# Altium project FPGA_XC6SLX9_2TQG144C.PrjPcb
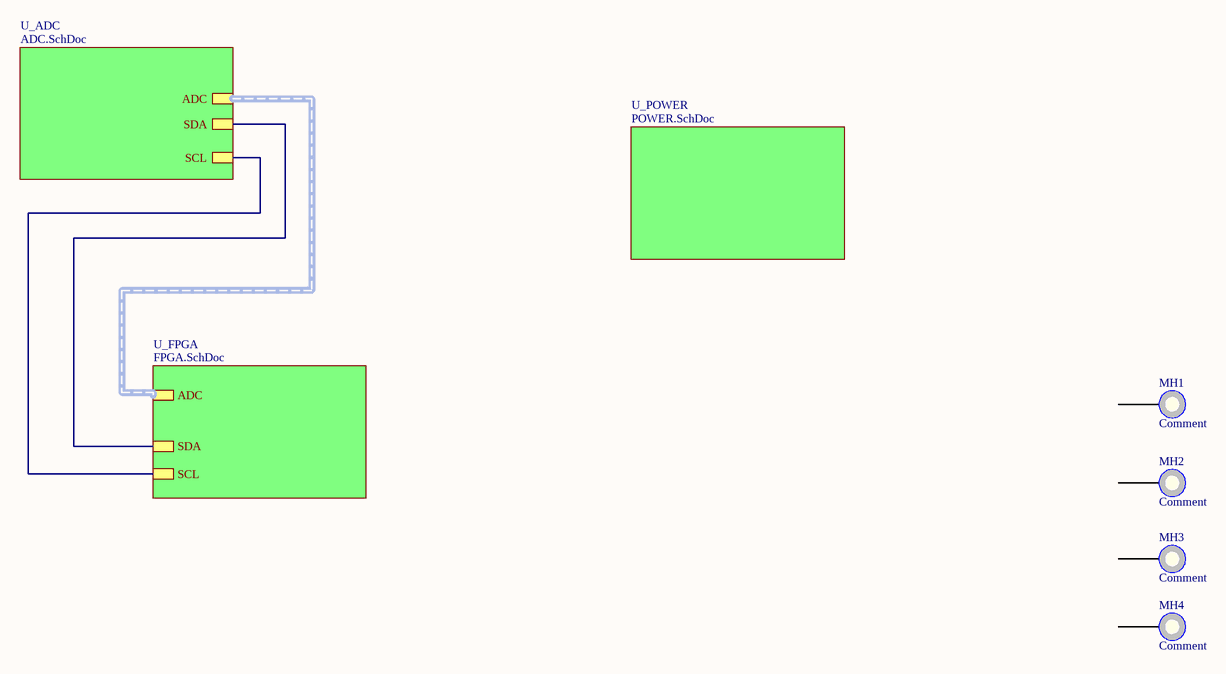
[diagram p0: TOP.SchDoc]
4 sheets, 93 parts. Net scope: hierarchical (ports join the sheet entries above them; power ports are global).
Board file: XC6SLX9-2TQG144C.PcbDoc
Sheets:
  TOP.SchDoc
    U_ADC = ADC.SchDoc
    U_FPGA = FPGA.SchDoc
    U_POWER = POWER.SchDoc

## Sheet TOP.SchDoc
size A4

### Parts
MH1  Comment  [m3_3.2x6]  (no BOM)
MH2  Comment  [m3_3.2x6]  (no BOM)
MH3  Comment  [m3_3.2x6]  (no BOM)
MH4  Comment  [m3_3.2x6]  (no BOM)

### Sub-sheets
U_ADC = ADC.SchDoc: SDA, SCL, ADC (harness CHANNEL)
U_FPGA = FPGA.SchDoc: SDA, SCL, ADC (harness CHANNEL)
U_POWER = POWER.SchDoc: no entries

### Nets
NetU1_111: sheet U_ADC/SDA, sheet U_FPGA/SDA
NetU1_115: sheet U_ADC/SCL, sheet U_FPGA/SCL

Not connected (* = marked no-connect by the designer): MH1 1; MH2 1; MH3 1; MH4 1

### Buses and harness runs
harness sheet U_ADC/ADC = sheet U_FPGA/ADC

### Library data of the parts
MH1-MH4 = M3_Vida: Que: 022; DesignItemID: Mounting Hole; Created On: 13.02.2020; Created By: Recep Aydin; Category: Miscellaneous; Part Number: M3_Vida

## Sheet ADC.SchDoc
size A4
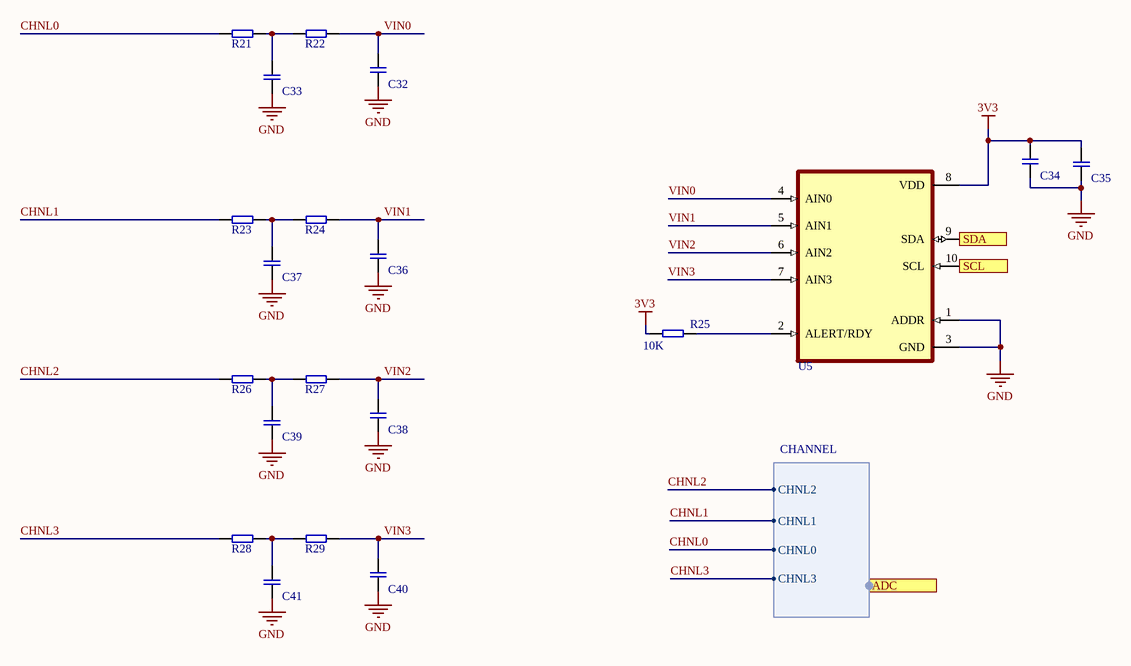
[diagram p1: ADC.SchDoc]

### Parts
C32  0.1uF  [C0603]  (value not drawn)
C33  0.1uF  [C0603]  (value not drawn)
C34  1uF  [C0603]  (value not drawn)
C35  10uF  [C0603]  (value not drawn)
C36  0.1uF  [C0603]  (value not drawn)
C37  0.1uF  [C0603]  (value not drawn)
C38  0.1uF  [C0603]  (value not drawn)
C39  0.1uF  [C0603]  (value not drawn)
C40  0.1uF  [C0603]  (value not drawn)
C41  0.1uF  [C0603]  (value not drawn)
R21  0R  [R0402]  (value not drawn)
R22  0R  [R0402]  (value not drawn)
R23  0R  [R0402]  (value not drawn)
R24  0R  [R0402]  (value not drawn)
R25  10K  [R0603]
R26  0R  [R0402]  (value not drawn)
R27  0R  [R0402]  (value not drawn)
R28  0R  [R0402]  (value not drawn)
R29  0R  [R0402]  (value not drawn)
U5  ADS1115IDGST  [ADS1115IDGST]  (value not drawn)

### Ports
ADC (harness CHANNEL), SCL, SDA

### Harnesses
CHANNEL: CHNL0, CHNL1, CHNL2, CHNL3

### Nets
3V3: C34.2 C35.2 R25.1 U5.8(VDD)
GND: C32.2 C33.1 C34.1 C35.1 C36.2 C37.1 C38.2 C39.1 C40.2 C41.1 U5.1(ADDR) U5.3(GND)
CHNL0: R21.1 ; port ADC.CHNL0
CHNL1: R23.1 ; port ADC.CHNL1
CHNL2: R26.1 ; port ADC.CHNL2
CHNL3: R28.1 ; port ADC.CHNL3
VIN0: C32.1 R22.2 U5.4(AIN0)
VIN1: C36.1 R24.2 U5.5(AIN1)
VIN2: C38.1 R27.2 U5.6(AIN2)
VIN3: C40.1 R29.2 U5.7(AIN3)
NetC33_2: C33.2 R21.2 R22.1
NetC37_2: C37.2 R23.2 R24.1
NetC39_2: C39.2 R26.2 R27.1
NetC41_2: C41.2 R28.2 R29.1
NetR25_2: R25.2 U5.2(ALERT/RDY)
NetU1_111: U5.9(SDA) ; port SDA
NetU1_115: U5.10(SCL) ; port SCL

### Library data of the parts
C32 C33 C36-C41 = C0603C104J4RACTU: CAP CER 0.1UF 16V X7R 0603; Manufacturer: KEMET; Que: 071; Tolerance: ±5%; Type: Ceramic; Name: Recep Aydin; Part Number: C0603C104J4RACTU; Voltage: 16V; Temperature Coefficient: X7R; Package: 0603(1608 Metric); Datasheet: https://content.kemet.com/datasheets/KEM_C1002_X7R_SMD.pdf; Manufacturer Part Number: C0603C104J4RACTU
C34 = GMC10X5R105K16NT: CAP CER 1UF 16V X5R 0603; Manufacturer: CAL-CHIP ELECTRONICS, INC.; Que: 020; Tolerance: ±10%; Type: Ceramic; Name: Recep Aydin; Part Number: GMC10X5R105K16NT; Voltage: 16V; Temperature Coefficient: X5R; Package: 0603(1608 Metric); Datasheet: http://www.calchipelectronics.com/pdf/gmc_series.pdf; Manufacturer Part Number: GMC10X5R105K16NT
C35 = GRT188R61C106KE13D: CAP CER 10UF 16V X5R 0603; Manufacturer: Murata Electronics; Que: 073; Tolerance: ±10%; Type: Ceramic; Name: Recep Aydin; Part Number: GRT188R61C106KE13D; Voltage: 16V; Temperature Coefficient: X5R; Package: 0603(1608 Metric); Datasheet: https://search.murata.co.jp/Ceramy/image/img/A01X/G101/ENG/GRT188R61C106KE13-01.pdf; Manufacturer Part Number: GRT188R61C106KE13D
R21-R24 R26-R29 = RMCF0402ZT0R00: RES 0 OHM JUMPER 1/16W 0402; Manufacturer: Stackpole Electronics Inc; Que: 056; Tolerance: 1%; Name: Recep Aydin; Part Number: RMCF0402ZT0R00; Resistor Type: Thick Film; Package: 0402; Datasheet: https://www.seielect.com/catalog/sei-rmcf_rmcp.pdf; Manufacturer Part Number: RMCF0402ZT0R00
R25 = RMCF0603FT10K0: RES 10K OHM 1% 1/10W 0603; Manufacturer: Stackpole Electronics Inc; Que: 051; Name: Recep Aydin; Part Number: RMCF0603FT10K0; Tolerance: 1%; Resistor Type: Thick Film; Package: 0603; Datasheet: https://www.seielect.com/catalog/sei-rmcf_rmcp.pdf; Manufacturer Part Number: RMCF0603FT10K0
U5 = ADS1115IDGST: IC ADC 16BIT SIGMA-DELTA 10VSSOP; Manufacturer: Texas Instruments; Que: 047; Name: İbrahim Akbulut; Package: 10VSSOP; Availability: Unavailable; Value: *; MP: ADS1115IDGST; Price: None; Part Number: ADS1115IDGST; Function: ADC; Datasheet: https://www.digikey.com/en/products/detail/texas-instruments/ADS1115IDGST/2123284; Manufacturer Part Number: ADS1115IDGST

## Sheet FPGA.SchDoc
size A2
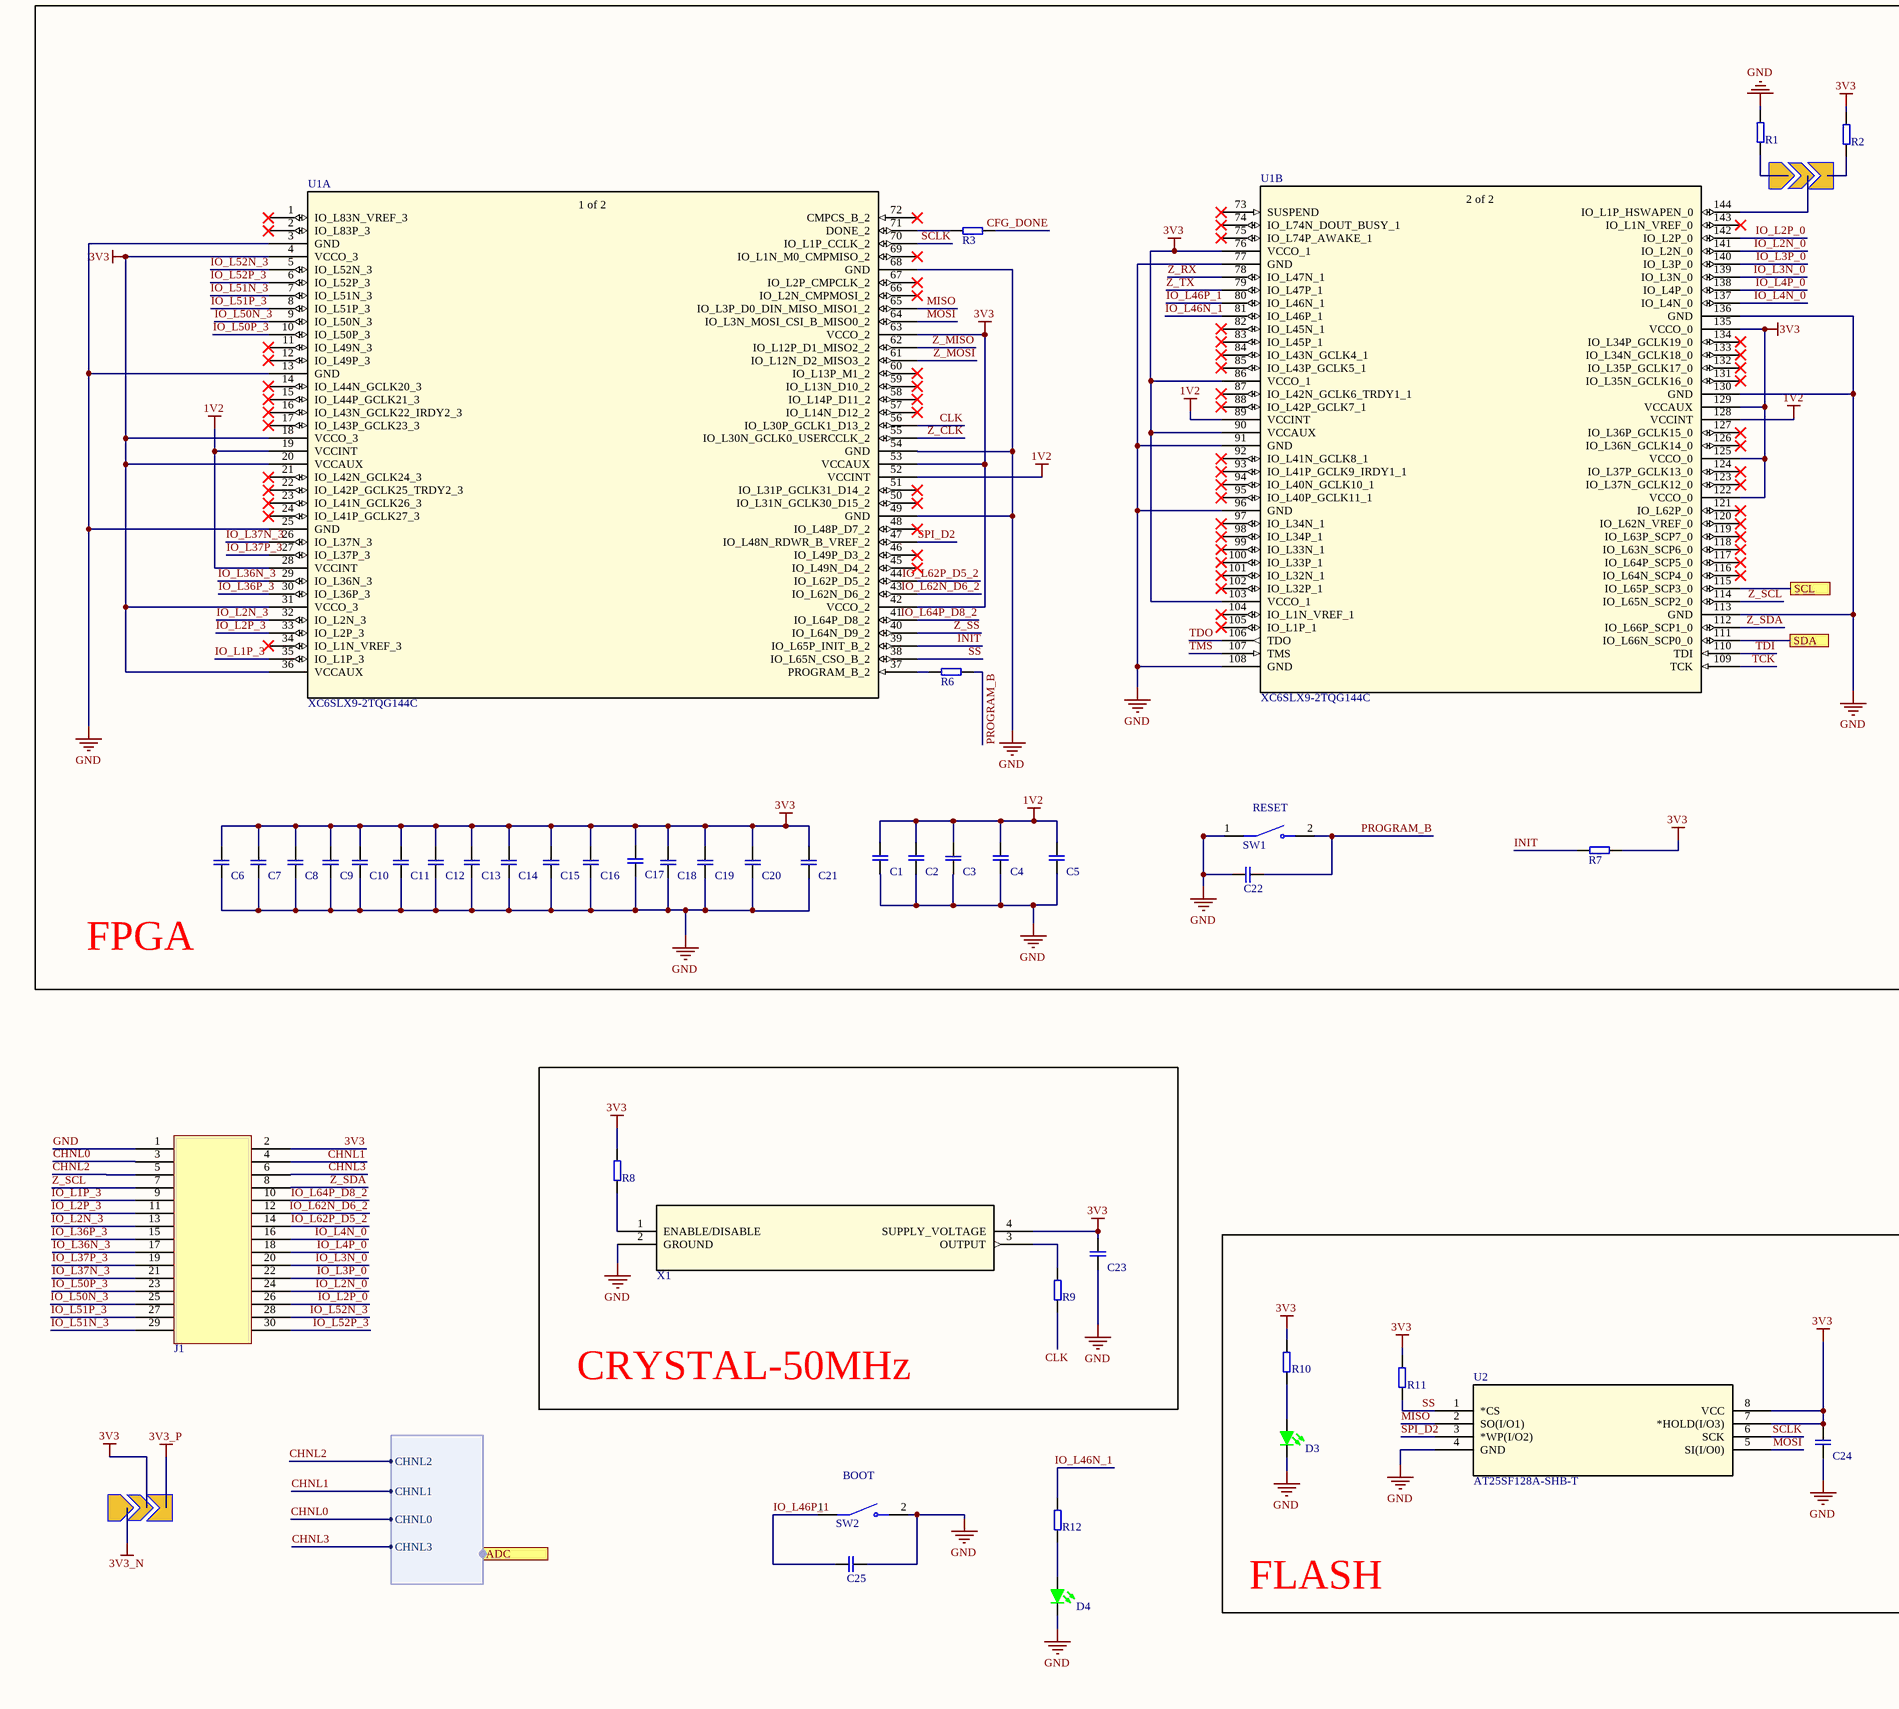
[diagram p2: FPGA.SchDoc, left]
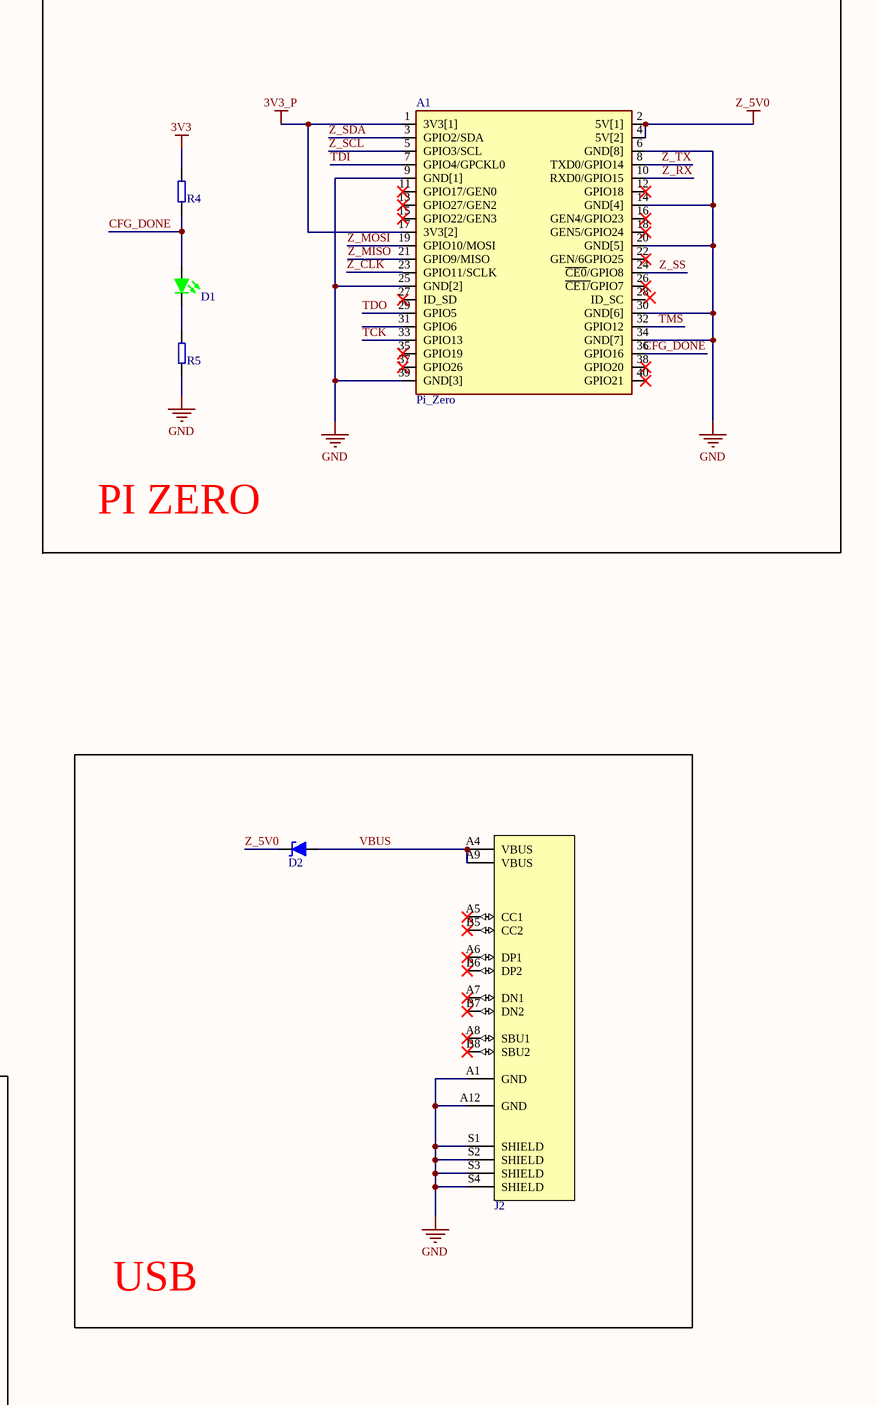
[diagram p3: FPGA.SchDoc, right]

### Parts
A1  Pi_Zero  [Pi_Zero]
C1  0.1uF  [C0402]  (value not drawn)
C2  0.1uF  [C0402]  (value not drawn)
C3  0.1uF  [C0402]  (value not drawn)
C4  0.1uF  [C0402]  (value not drawn)
C5  0.1uF  [C0402]  (value not drawn)
C6  0.1uF  [C0402]  (value not drawn)
C7  0.1uF  [C0402]  (value not drawn)
C8  0.1uF  [C0402]  (value not drawn)
C9  0.1uF  [C0402]  (value not drawn)
C10  0.1uF  [C0402]  (value not drawn)
C11  0.1uF  [C0402]  (value not drawn)
C12  0.1uF  [C0402]  (value not drawn)
C13  0.1uF  [C0402]  (value not drawn)
C14  0.1uF  [C0402]  (value not drawn)
C15  0.1uF  [C0402]  (value not drawn)
C16  0.1uF  [C0402]  (value not drawn)
C17  0.1uF  [C0402]  (value not drawn)
C18  0.1uF  [C0402]  (value not drawn)
C19  0.1uF  [C0402]  (value not drawn)
C20  0.1uF  [C0402]  (value not drawn)
C21  0.1uF  [C0402]  (value not drawn)
C22  0.1uF  [C0402]  (value not drawn)
C23  0.01uF  [C0402]  (value not drawn)
C24  0.1uF  [C0402]  (value not drawn)
C25  0.1uF  [C0402]  (value not drawn)
D1  SML-LX0603GW-TR  [L0603]  (value not drawn)
D2  SMBJ5.0A  [DO-214AA (SMBJ)]  (value not drawn)
D3  SML-LX0603GW-TR  [L0603]  (value not drawn)
D4  SML-LX0603GW-TR  [L0603]  (value not drawn)
J1  20021321-00030T4LF  [CONN_30P_1.27MM_SMD]  (value not drawn)
J2  TYPE-C  [USB4105-GF-TYPEC]  (value not drawn)
JMP1  Jumper  [SB0402_3PAD]  (value not drawn)
JMP2  Jumper  [SB0402_3PAD]  (value not drawn)
R1  4.7K  [R0402]  (value not drawn)
R2  4.7K  [R0402]  (value not drawn)
R3  4.7K  [R0402]  (value not drawn)
R4  1K  [R0402]  (value not drawn)
R5  1K  [R0402]  (value not drawn)
R6  4.7K  [R0402]  (value not drawn)
R7  4.7K  [R0402]  (value not drawn)
R8  1K  [R0402]  (value not drawn)
R9  27R  [R0402]  (value not drawn)
R10  1K  [R0402]  (value not drawn)
R11  1K  [R0402]  (value not drawn)
R12  1K  [R0402]  (value not drawn)
SW1  B3U-1000P  [B3U-1000P]  (value not drawn)
SW2  B3U-1000P  [B3U-1000P]  (value not drawn)
U1  XC6SLX9-2TQG144C  [TQG144_XIL-M]  (parts A,B of 2)
U2  AT25SF128A-SHB-T  [AT25SF128A-SHB-T]
X1  CRYSTAL OSC. 50MHz 3.3V 15pF 50PPM HCMOS SMT  [COM1305_RAL-L]  (value not drawn)

### Blocks framed on the sheet
PI ZERO: A1 D1 R4 R5
USB: D2 J2
CRYSTAL-50MHz: C23 R8 R9 X1
FLASH: C24 D3 R10 R11 U2

### Ports
ADC (harness CHANNEL), SCL, SDA

### Harnesses
CHANNEL: CHNL0, CHNL1, CHNL2, CHNL3

### Nets
1V2: C1.2 C2.2 C3.2 C4.2 C5.2 U1.19(VCCINT) U1.28(VCCINT) U1.52(VCCINT) U1.89(VCCINT) U1.128(VCCINT)
3V3: C6.2 C7.2 C8.2 C9.2 C10.2 C11.2 C12.2 C13.2 C14.2 C15.2 C16.2 C17.2 C18.2 C19.2 C20.2 C21.2 C23.2 C24.2 J1.2 JMP2.2 R2.2 R4.2 R7.2 R8.2 R10.2 R11.2 U1.4(VCCO_3) U1.18(VCCO_3) U1.20(VCCAUX) U1.31(VCCO_3) U1.36(VCCAUX) U1.42(VCCO_2) U1.53(VCCAUX) U1.63(VCCO_2) U1.76(VCCO_1) U1.86(VCCO_1) U1.90(VCCAUX) U1.103(VCCO_1) U1.122(VCCO_0) U1.125(VCCO_0) U1.129(VCCAUX) U1.135(VCCO_0) U2.7(*HOLD(I/O3)) U2.8(VCC) X1.4(SUPPLY_VOLTAGE)
3V3_N: JMP2.1
3V3_P: A1.1(3V3[1]) A1.17(3V3[2]) JMP2.3
GND: A1.6(GND[8]) A1.9(GND[1]) A1.14(GND[4]) A1.20(GND[5]) A1.25(GND[2]) A1.30(GND[6]) A1.34(GND[7]) A1.39(GND[3]) C1.1 C2.1 C3.1 C4.1 C5.1 C6.1 C7.1 C8.1 C9.1 C10.1 C11.1 C12.1 C13.1 C14.1 C15.1 C16.1 C17.1 C18.1 C19.1 C20.1 C21.1 C22.2 C23.1 C24.1 C25.1 D3.C D4.C J1.1 J2.A1(GND) J2.A12(GND) J2.S1(SHIELD) J2.S2(SHIELD) J2.S3(SHIELD) J2.S4(SHIELD) R1.2 R5.1 SW1.1 SW2.2 U1.3(GND) U1.13(GND) U1.25(GND) U1.49(GND) U1.54(GND) U1.68(GND) U1.77(GND) U1.91(GND) U1.96(GND) U1.108(GND) U1.113(GND) U1.130(GND) U1.136(GND) U2.4(GND) X1.2(GROUND)
Z_5V0: A1.2(5V[1]) A1.4(5V[2]) D2.C
CFG_DONE: A1.36(GPIO16) D1.A R3.2 R4.1
CHNL0: J1.3 ; port ADC.CHNL0
CHNL1: J1.4 ; port ADC.CHNL1
CHNL2: J1.5 ; port ADC.CHNL2
CHNL3: J1.6 ; port ADC.CHNL3
CLK: R9.1 U1.56(IO_L30P_GCLK1_D13_2)
INIT: R7.1 U1.39(IO_L65P_INIT_B_2)
IO_L1P_3: J1.9 U1.35(IO_L1P_3)
IO_L2N_0: J1.24 U1.141(IO_L2N_0)
IO_L2N_3: J1.13 U1.32(IO_L2N_3)
IO_L2P_0: J1.26 U1.142(IO_L2P_0)
IO_L2P_3: J1.11 U1.33(IO_L2P_3)
IO_L3N_0: J1.20 U1.139(IO_L3N_0)
IO_L3P_0: J1.22 U1.140(IO_L3P_0)
IO_L4N_0: J1.16 U1.137(IO_L4N_0)
IO_L4P_0: J1.18 U1.138(IO_L4P_0)
IO_L36N_3: J1.17 U1.29(IO_L36N_3)
IO_L36P_3: J1.15 U1.30(IO_L36P_3)
IO_L37N_3: J1.21 U1.26(IO_L37N_3)
IO_L37P_3: J1.19 U1.27(IO_L37P_3)
IO_L46N_1: R12.2 U1.81(IO_L46P_1)
IO_L46P_1: C25.2 SW2.1 U1.80(IO_L46N_1)
IO_L50N_3: J1.25 U1.9(IO_L50N_3)
IO_L50P_3: J1.23 U1.10(IO_L50P_3)
IO_L51N_3: J1.29 U1.7(IO_L51N_3)
IO_L51P_3: J1.27 U1.8(IO_L51P_3)
IO_L52N_3: J1.28 U1.5(IO_L52N_3)
IO_L52P_3: J1.30 U1.6(IO_L52P_3)
IO_L62N_D6_2: J1.12 U1.43(IO_L62N_D6_2)
IO_L62P_D5_2: J1.14 U1.44(IO_L62P_D5_2)
IO_L64P_D8_2: J1.10 U1.41(IO_L64P_D8_2)
MISO: U1.65(IO_L3P_D0_DIN_MISO_MISO1_2) U2.2(SO(I/O1))
MOSI: U1.64(IO_L3N_MOSI_CSI_B_MISO0_2) U2.5(SI(I/O0))
PROGRAM_B: C22.1 R6.1 SW1.2
SCLK: U1.70(IO_L1P_CCLK_2) U2.6(SCK)
SPI_D2: U1.47(IO_L48N_RDWR_B_VREF_2) U2.3(*WP(I/O2))
SS: R11.1 U1.38(IO_L65N_CSO_B_2) U2.1(*CS)
TCK: A1.33(GPIO13) U1.109(TCK)
TDI: A1.7(GPIO4/GPCKL0) U1.110(TDI)
TDO: A1.29(GPIO5) U1.106(TDO)
TMS: A1.32(GPIO12) U1.107(TMS)
VBUS: D2.A J2.A4(VBUS) J2.A9(VBUS)
Z_CLK: A1.23(GPIO11/SCLK) U1.55(IO_L30N_GCLK0_USERCCLK_2)
Z_MISO: A1.21(GPIO9/MISO) U1.62(IO_L12P_D1_MISO2_2)
Z_MOSI: A1.19(GPIO10/MOSI) U1.61(IO_L12N_D2_MISO3_2)
Z_RX: A1.10(RXD0/GPIO15) U1.78(IO_L47N_1)
Z_SCL: A1.5(GPIO3/SCL) J1.7 U1.114(IO_L65N_SCP2_0)
Z_SDA: A1.3(GPIO2/SDA) J1.8 U1.112(IO_L66P_SCP1_0)
Z_SS: A1.24(~{CE0}/GPIO8) U1.40(IO_L64N_D9_2)
Z_TX: A1.8(TXD0/GPIO14) U1.79(IO_L47P_1)
NetD1_C: D1.C R5.2
NetD3_A: D3.A R10.1
NetD4_A: D4.A R12.1
NetJMP1_1: JMP1.1 R1.1
NetJMP1_2: JMP1.2 U1.144(IO_L1P_HSWAPEN_0)
NetJMP1_3: JMP1.3 R2.1
NetR3_1: R3.1 U1.71(DONE_2)
NetR6_2: R6.2 U1.37(PROGRAM_B_2)
NetR8_1: R8.1 X1.1(ENABLE/DISABLE)
NetR9_2: R9.2 X1.3(OUTPUT)
NetU1_111: U1.111(IO_L66N_SCP0_0) ; port SDA
NetU1_115: U1.115(IO_L65P_SCP3_0) ; port SCL

Not connected (* = marked no-connect by the designer): A1 11(GPIO17/GEN0)* 12(GPIO18)* 13(GPIO27/GEN2)* 15(GPIO22/GEN3)* 16(GEN4/GPIO23)* 18(GEN5/GPIO24)* 22(GEN/6GPIO25)* 26(~{CE1/}GPIO7)* 27(ID_SD)* 28(ID_SC) 31(GPIO6) 35(GPIO19)* 37(GPIO26)* 38(GPIO20)* 40(GPIO21)*; J2 A5(CC1)* A6(DP1)* A7(DN1)* A8(SBU1)* B5(CC2)* B6(DP2)* B7(DN2)* B8(SBU2)*; U1 1(IO_L83N_VREF_3)* 2(IO_L83P_3)* 11(IO_L49N_3)* 12(IO_L49P_3)* 14(IO_L44N_GCLK20_3)* 15(IO_L44P_GCLK21_3)* 16(IO_L43N_GCLK22_IRDY2_3)* 17(IO_L43P_GCLK23_3)* 21(IO_L42N_GCLK24_3)* 22(IO_L42P_GCLK25_TRDY2_3)* 23(IO_L41N_GCLK26_3)* 24(IO_L41P_GCLK27_3)* 34(IO_L1N_VREF_3)* 45(IO_L49N_D4_2)* 46(IO_L49P_D3_2)* 48(IO_L48P_D7_2)* 50(IO_L31N_GCLK30_D15_2)* 51(IO_L31P_GCLK31_D14_2)* 57(IO_L14N_D12_2)* 58(IO_L14P_D11_2)* 59(IO_L13N_D10_2)* 60(IO_L13P_M1_2)* 66(IO_L2N_CMPMOSI_2)* 67(IO_L2P_CMPCLK_2)* 69(IO_L1N_M0_CMPMISO_2)* 72(CMPCS_B_2)* 73(SUSPEND)* 74(IO_L74N_DOUT_BUSY_1)* 75(IO_L74P_AWAKE_1)* 82(IO_L45N_1)* 83(IO_L45P_1)* 84(IO_L43N_GCLK4_1)* 85(IO_L43P_GCLK5_1)* 87(IO_L42N_GCLK6_TRDY1_1)* 88(IO_L42P_GCLK7_1)* 92(IO_L41N_GCLK8_1)* 93(IO_L41P_GCLK9_IRDY1_1)* 94(IO_L40N_GCLK10_1)* 95(IO_L40P_GCLK11_1)* 97(IO_L34N_1)* 98(IO_L34P_1)* 99(IO_L33N_1)* 100(IO_L33P_1)* 101(IO_L32N_1)* 102(IO_L32P_1)* 104(IO_L1N_VREF_1)* 105(IO_L1P_1)* 116(IO_L64N_SCP4_0)* 117(IO_L64P_SCP5_0)* 118(IO_L63N_SCP6_0)* 119(IO_L63P_SCP7_0)* 120(IO_L62N_VREF_0)* 121(IO_L62P_0)* 123(IO_L37N_GCLK12_0)* 124(IO_L37P_GCLK13_0)* 126(IO_L36N_GCLK14_0)* 127(IO_L36P_GCLK15_0)* 131(IO_L35N_GCLK16_0)* 132(IO_L35P_GCLK17_0)* 133(IO_L34N_GCLK18_0)* 134(IO_L34P_GCLK19_0)* 143(IO_L1N_VREF_0)*

### Notes on the sheet
- (near SW1) RESET
- FPGA
- (near SW2) BOOT
- (in symbol XC6SLX9-2TQG144C, part A) 1 of 2
- (in symbol XC6SLX9-2TQG144C, part B) 2 of 2

### Library data of the parts
A1 = Pi_Zero: MP: ADA3708; Que: 033; Availability: Unavailable; Package: None; Value: *; Price: None; Part Number: Pi_Zero
C1-C21 = GRM155R61H104KE14D: CAP CER 0.1UF 50V X5R 0402; Manufacturer: Murata Electronics; Que: 068; Tolerance: ±10%; Type: Ceramic; Name: Recep Aydin; Part Number: GRM155R61H104KE14D; Voltage: 50V; Temperature Coefficient: X5R; Package: 0402(1005 Metric); Datasheet: https://search.murata.co.jp/Ceramy/image/img/A01X/G101/ENG/GRM155R61H104KE14-01.pdf; Manufacturer Part Number: GRM155R61H104KE14D
C22 C24 C25 = C1005X5R1A104K050BA: CAP CER 0.1UF 10V X5R 0402; Manufacturer: TDK Corporation; Que: 003; Tolerance: ±10%; Type: Ceramic; Name: Recep Aydin; Part Number: C1005X5R1A104K050BA; Voltage: 10V; Temperature Coefficient: X5R; Package: 0402(1005 Metric); Datasheet: https://product.tdk.com/en/system/files?file=dam/doc/product/capacitor/ceramic/mlcc/catalog/mlcc_commercial_general_en.pdf; Manufacturer Part Number: C1005X5R1A104K050BA
C23 = GMC04X7R103J10NT: CAP CER 0.01UF 10V X7R 0402; Manufacturer: CAL-CHIP ELECTRONICS, INC.; Que: 026; Tolerance: ±5%; Type: Ceramic; Name: Recep Aydin; Part Number: GMC04X7R103J10NT; Voltage: 10V; Temperature Coefficient: X7R; Package: 0402(1005 Metric); Datasheet: http://www.calchipelectronics.com/pdf/gmc_series.pdf; Manufacturer Part Number: GMC04X7R103J10NT
D1 D3 D4 = SML-LX0603GW-TR: LED GREEN DIFFUSED SMD; Manufacturer: Lumex Opto/Components Inc.; Que: 001; Forward Voltage: 2.2V; Current: 20mA; Name: Recep Aydin; Part Number: SML-LX0603GW-TR; LensTransparency: Diffused; Color: Green; Package: 0603(1608 Metric); Datasheet: https://www.lumex.com/datasheet/SML-LX0603GW-TR; Manufacturer Part Number: SML-LX0603GW-TR
D2 = SMBJ5.0A: TVS DIODE 5VWM 9.2VC DO214AA; Manufacturer: LittelFuse; Que: 025; Current: 65.3A; Name: AEG; SPN: SMBJ5.0ALFCT-ND; Part Number: SMBJ5.0A; Diode Type: TVS; Package: DO-214AA (SMBJ); Datasheet: https://cdn-reichelt.de/documents/datenblatt/A400/SMBJ_LITTELFUSE_DATASHEET.pdf; Manufacturer Part Number: SMBJ5.0A
J1 = 20021321-00030T4LF: CONN RCPT 30POS 0.05 GOLD SMD; Manufacturer: Amphenol ICC (FCI); Que: 051; Number of Position: 30; Connector Style: Header,Female Pin; Name: Ahmet Kemal Ayyildiz; Part Number: 20021321-00030T4LF; Mounting Type: Surface Mount; Contact Finish: Gold; Datasheet: https://media.digikey.com/pdf/Data%20Sheets/FCI%20PDFs/Minitek%20127_Catalog.pdf; Manufacturer Part Number: 20021321-00030T4LF; Date: 20-01-2022
J2 = USB4105-GF-TYPEC: MP: USB4125-GF-A_REVA2; Que: 111; Package: None; Availability: Unavailable; Value: *; Price: None; Part Number: USB4105-GF-TYPEC; Datasheet: https://gct.co/files/drawings/usb4105.pdf
JMP1 JMP2 = Solder Bridge0402_3pad: 0402 Solder Bridge 3 PAD; Que: 008; Name: Recep Aydin; Part Number: Solder Bridge0402_3pad
R1-R3 R6 R7 = CRCW04024K70FKED: RES SMD 4.7K OHM 1% 1/16W 0402; Manufacturer: Vishay Dale; Que: 017; Tolerance: 0.1%; Name: Recep Aydin; Part Number: CRCW04024K70FKED; Resistor Type: Thick Film; Package: 0402; Datasheet: https://www.vishay.com/docs/20035/dcrcwe3.pdf; Manufacturer Part Number: CRCW04024K70FKED
R4 R5 R8 R10-R12 = RT0402BRE071KL: RES SMD 1K OHM 0.1% 1/16W 0402; Manufacturer: Yageo; Que: 015; Name: Recep Aydin; Part Number: RT0402BRE071KL; Tolerance: 0.1%; Resistor Type: Thick Film; Package: 0402; Datasheet: https://www.yageo.com/upload/media/product/productsearch/datasheet/rchip/PYu-RT_1-to-0.01_RoHS_L_12.pdf; Manufacturer Part Number: RT0402BRE071KL
R9 = 0402WGJ0270TCE: RES.(1005) 0402 27 Ohms 5% 1/16W 200PPM; Que: 162; Part Number: 0402WGJ0270TCE
SW1 SW2 = B3U-1000P: SWITCH TACTILE SPST-NO 0.05A 12V; Manufacturer: Omron Electronics Inc-EMC Div; Que: 006; Switch Function: Off-Mom; Contact Rating: 0.05A @ 12VDC; Actuator Type: Standard; Name: Ahmet Kemal Ayyildiz; Part Number: B3U-1000P; Circuit: SPST-NO; Datasheet: https://omronfs.omron.com/en_US/ecb/products/pdf/en-b3u.pdf; Manufacturer Part Number: B3U-1000P
U1 = XC6SLX9-2TQG144C: Mfr_Name: Xilinx Inc; Que: 034; Copyright: Copyright (C) 2024 Ultra Librarian. All rights reserved.; Manufacturer_Part_Number: XC6SLX9-2TQG144C; RefDes: RefDes; Type: DEV; Part Number: XC6SLX9-2TQG144C
U2 = AT25SF128A-SHB-T: Mfr_Name: Adesto Technologies; Que: 079; Copyright: Copyright (C) 2024 Ultra Librarian. All rights reserved.; Manufacturer_Part_Number: AT25SF128A-SHB-T; RefDes: RefDes; Type: DEV; Part Number: AT25SF128A-SHB-T
X1 = COM1305-50.000-EXT-T-TR: Mfr_Name: Raltron; Que: 016; Type: DEV; Copyright: Copyright (C) 2024 Ultra Librarian. All rights reserved.; Manufacturer_Part_Number: COM1305-50.000-EXT-T-TR; RefDes: RefDes; Part Number: COM1305-50.000-EXT-T-TR

## Sheet POWER.SchDoc
size A4
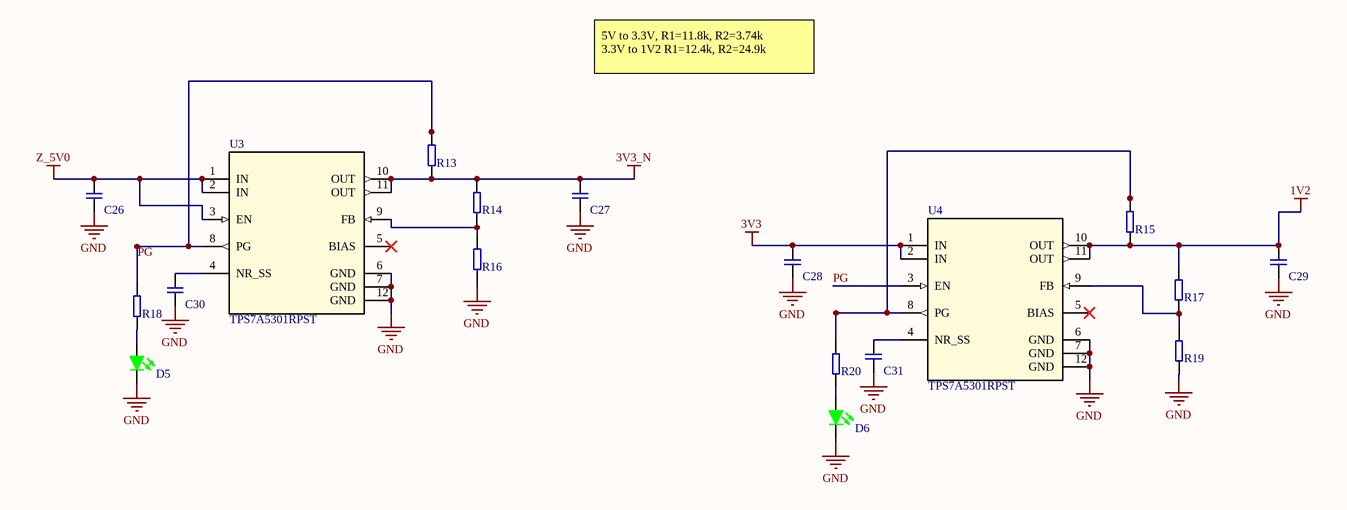
[diagram p4: POWER.SchDoc]

### Parts
C26  47uF  [C1210]  (value not drawn)
C27  47uF  [C0805]  (value not drawn)
C28  47uF  [C1210]  (value not drawn)
C29  47uF  [C0805]  (value not drawn)
C30  100nF  [C0402]  (value not drawn)
C31  100nF  [C0402]  (value not drawn)
D5  SML-LX0603GW-TR  [L0603]  (value not drawn)
D6  SML-LX0603GW-TR  [L0603]  (value not drawn)
R13  1K  [R0402]  (value not drawn)
R14  11.8K  [R0603]  (value not drawn)
R15  1K  [R0402]  (value not drawn)
R16  3.74K  [R0603]  (value not drawn)
R17  12.4K  [R0402]  (value not drawn)
R18  1K  [R0402]  (value not drawn)
R19  24.9K  [R0402]  (value not drawn)
R20  1K  [R0402]  (value not drawn)
U3  TPS7A5301RPST  [RPS0012A-MFG]
U4  TPS7A5301RPST  [RPS0012A-MFG]

### Nets
1V2: C29.2 R15.1 R17.2 U4.10(OUT) U4.11(OUT)
3V3: C28.2 U4.1(IN) U4.2(IN)
3V3_N: C27.2 R13.1 R14.2 U3.10(OUT) U3.11(OUT)
GND: C26.1 C27.1 C28.1 C29.1 C30.1 C31.1 D5.C D6.C R16.1 R19.1 U3.6(GND) U3.7(GND) U3.12(GND) U4.6(GND) U4.7(GND) U4.12(GND)
Z_5V0: C26.2 U3.1(IN) U3.2(IN) U3.3(EN)
PG: R13.2 R18.2 U3.8(PG) U4.3(EN)
NetC30_2: C30.2 U3.4(NR_SS)
NetC31_2: C31.2 U4.4(NR_SS)
NetD5_A: D5.A R18.1
NetD6_A: D6.A R20.1
NetR14_1: R14.1 R16.2 U3.9(FB)
NetR15_2: R15.2 R20.2 U4.8(PG)
NetR17_1: R17.1 R19.2 U4.9(FB)

Not connected (* = marked no-connect by the designer): U3 5(BIAS)*; U4 5(BIAS)*

### Notes on the sheet
- 5V to 3.3V, R1=11.8k, R2=3.74k             3.3V to 1V2 R1=12.4k, R2=24.9k

### Library data of the parts
C26 C28 = CL32A476KOJNNNE: MLCC (3225) 1210 47uF 16VDC ±10% X5R; Que: 141; Part Number: CL32A476KOJNNNE
C27 C29 = C2012X5R1A476M125AC: MLCC (2012) 0805 47uF 10VDC ±20% X5R; Que: 136; Part Number: C2012X5R1A476M125AC
C30 C31 = CL05B104KB5NNNC: 402; Que: 129; Part Number: CL05B104KB5NNNC
D5 D6 = SML-LX0603GW-TR: as D1 on sheet FPGA; Part Number: SML-LX0603GW-TR; LensTransparency: Diffused; Color: Green; Package: 0603(1608 Metric); Datasheet: https://www.lumex.com/datasheet/SML-LX0603GW-TR; Manufacturer Part Number: SML-LX0603GW-TR
R13 R15 R18 R20 = RT0402BRE071KL: as R4 on sheet FPGA; Part Number: RT0402BRE071KL; Tolerance: 0.1%; Resistor Type: Thick Film; Package: 0402; Datasheet: https://www.yageo.com/upload/media/product/productsearch/datasheet/rchip/PYu-RT_1-to-0.01_RoHS_L_12.pdf; Manufacturer Part Number: RT0402BRE071KL
R14 = RMCF0603FT11K8: RES 11.8K OHM 1% 1/10W 0603; Manufacturer: Stackpole Electronics Inc; Que: 036; Tolerance: 0.1%; Name: Recep Aydin; Part Number: RMCF0603FT11K8; Resistor Type: Thick Film; Package: 0603; Datasheet: https://www.seielect.com/catalog/sei-rmcf_rmcp.pdf; Manufacturer Part Number: RMCF0603FT11K8
R16 = RC0603FR-073K74L: RES 3.74K OHM 1% 1/10W 0603; Manufacturer: YAGEO; Que: 075; Name: Recep Aydin; Part Number: RC0603FR-073K74L; Tolerance: 1%; Resistor Type: Thick Film; Package: 0603; Datasheet: https://www.yageo.com/upload/media/product/productsearch/datasheet/rchip/PYu-RC_Group_51_RoHS_L_11.pdf; Manufacturer Part Number: RC0603FR-073K74L
R17 = RC0402FR-0712K4L: RES 12.4K OHM 1% 1/16W 0402; Que: 178; Part Number: RC0402FR-0712K4L
R19 = RC0402FR-0724K9L: RES 24.9K OHM 1% 1/16W 0402; Que: 179; Part Number: RC0402FR-0724K9L
U3 U4 = TPS7A5301RPST: Mfr_Name: Texas Instruments; Que: 047; Type: DEV; RefDes: RefDes; Copyright: Copyright (C) 2024 Ultra Librarian. All rights reserved.; Manufacturer_Part_Number: TPS7A5301RPST; Part Number: TPS7A5301RPST

## Nets that join several sheets
1V2: FPGA (10 pins), POWER (5 pins)
3V3: ADC (C34.2 C35.2 R25.1 U5.8), FPGA (45 pins), POWER (C28.2 U4.1 U4.2)
3V3_N: FPGA (JMP2.1), POWER (5 pins)
GND: ADC (12 pins), FPGA (61 pins), POWER (16 pins)
Z_5V0: FPGA (A1.2 A1.4 D2.C), POWER (C26.2 U3.1 U3.2 U3.3)
CHNL0: ADC (R21.1), FPGA (J1.3)
CHNL1: ADC (R23.1), FPGA (J1.4)
CHNL2: ADC (R26.1), FPGA (J1.5)
CHNL3: ADC (R28.1), FPGA (J1.6)
NetU1_111: ADC (U5.9), FPGA (U1.111)
NetU1_115: ADC (U5.10), FPGA (U1.115)